# Altium schematic sheet Analog Ball Sensor.SchDoc
size A4
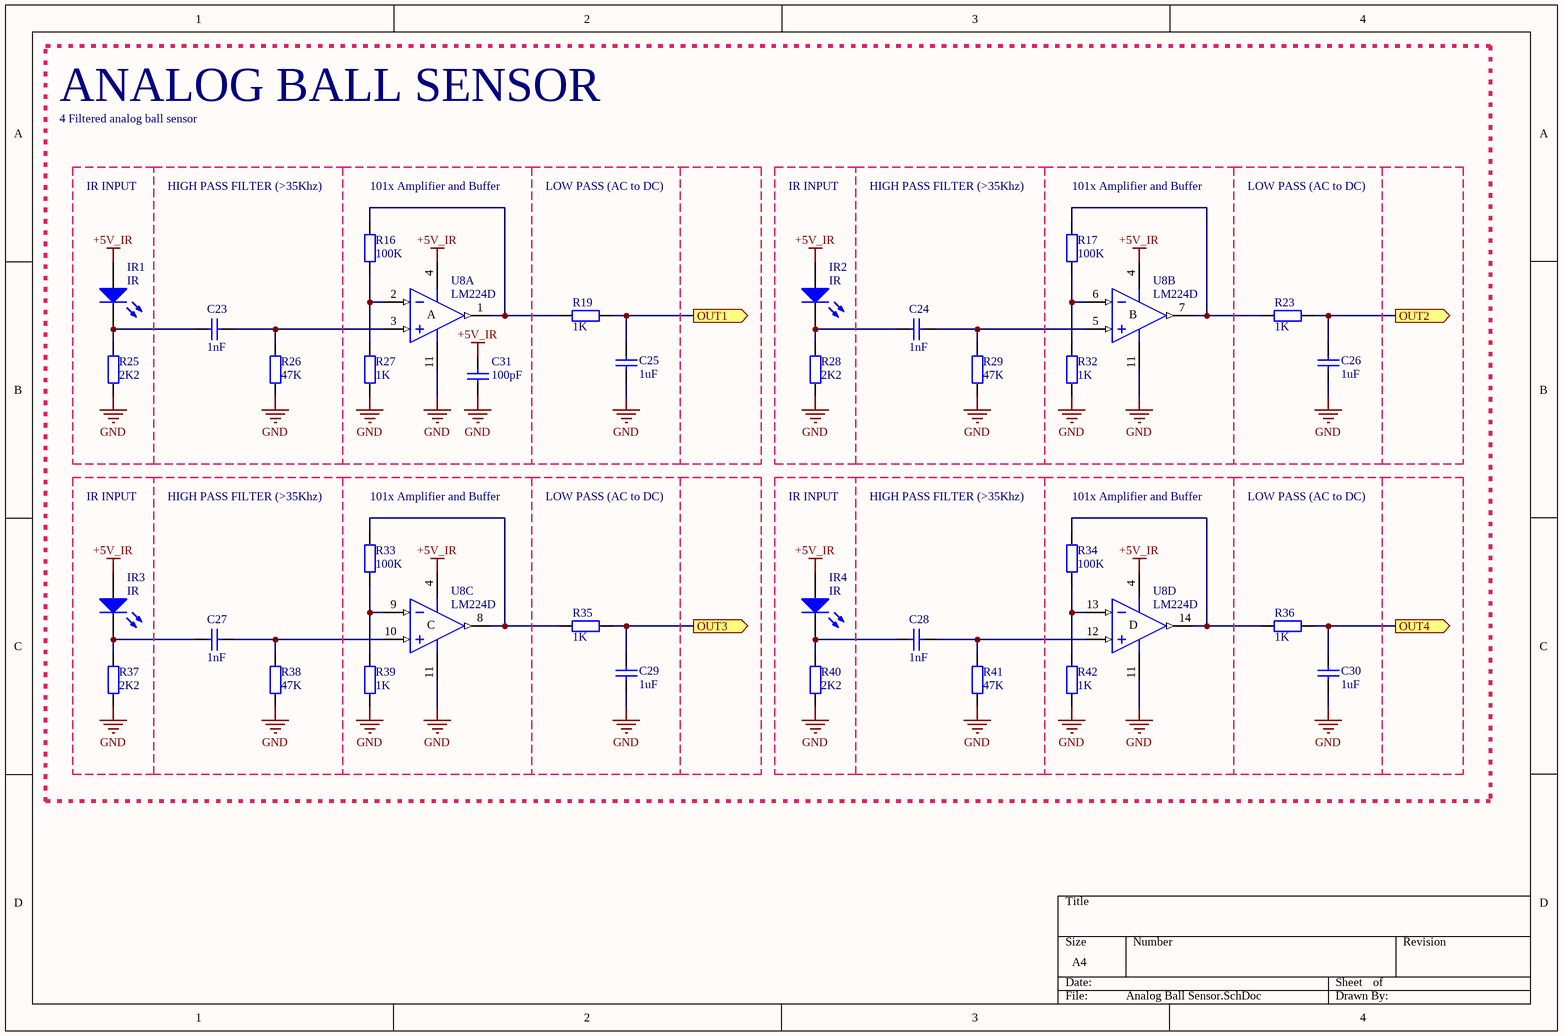
[diagram p0: Analog Ball Sensor.SchDoc]

## Parts
C23  1nF  [C0805]
C24  1nF  [C0805]
C25  1uF  [C0805]
C26  1uF  [C0805]
C27  1nF  [C0805]
C28  1nF  [C0805]
C29  1uF  [C0805]
C30  1uF  [C0805]
C31  value 100pF  [6-0805_N]  (hidden comment: Cap Semi)
IR1  IR  [LED-5mm - Horizontal]
IR2  IR  [LED-5mm - Horizontal]
IR3  IR  [LED-5mm - Horizontal]
IR4  IR  [LED-5mm - Horizontal]
R16  100K  [RES1206]
R17  100K  [RES1206]
R19  1K  [RES1206]
R23  1K  [RES1206]
R25  2K2  [RES1206]
R26  47K  [RES1206]
R27  1K  [RES1206]
R28  2K2  [RES1206]
R29  47K  [RES1206]
R32  1K  [RES1206]
R33  100K  [RES1206]
R34  100K  [RES1206]
R35  1K  [RES1206]
R36  1K  [RES1206]
R37  2K2  [RES1206]
R38  47K  [RES1206]
R39  1K  [RES1206]
R40  2K2  [RES1206]
R41  47K  [RES1206]
R42  1K  [RES1206]
U8  LM224D  [SO14_N]  (parts A,B,C,D of 4)

## Blocks framed on the sheet
ANALOG BALL SENSOR: C23-C31 R16 R17 R19 R23 R26 R27 R29 R32-R36 R38 R39 R41 R42 U8
IR INPUT: IR1 R25
IR INPUT: IR2 R28
IR INPUT: IR3 R37
IR INPUT: IR4 R40

## Ports
OUT1 (out), OUT2 (out), OUT3 (out), OUT4 (out)

## Nets
+5V_IR: C31.2 IR1.1(A) IR2.1(A) IR3.1(A) IR4.1(A) U8.4(V+)
GND: C25.2 C26.2 C29.2 C30.2 C31.1 R25.1 R26.2 R27.2 R28.1 R29.2 R32.2 R37.1 R38.2 R39.2 R40.1 R41.2 R42.2 U8.11(V-)
OUT1: C25.1 R19.2 ; port OUT1
OUT2: C26.1 R23.2 ; port OUT2
OUT3: C29.1 R35.2 ; port OUT3
OUT4: C30.1 R36.2 ; port OUT4
NetC23_1: C23.1 R26.1 U8.3(IN+)
NetC23_2: C23.2 IR1.2(K) R25.2
NetC24_1: C24.1 R29.1 U8.5(IN+)
NetC24_2: C24.2 IR2.2(K) R28.2
NetC27_1: C27.1 R38.1 U8.10(IN+)
NetC27_2: C27.2 IR3.2(K) R37.2
NetC28_1: C28.1 R41.1 U8.12(IN+)
NetC28_2: C28.2 IR4.2(K) R40.2
NetR16_1: R16.1 R19.1 U8.1(OUT)
NetR16_2: R16.2 R27.1 U8.2(IN-)
NetR17_1: R17.1 R23.1 U8.7(OUT)
NetR17_2: R17.2 R32.1 U8.6(IN-)
NetR33_1: R33.1 R35.1 U8.8(OUT)
NetR33_2: R33.2 R39.1 U8.9(IN-)
NetR34_1: R34.1 R36.1 U8.14(OUT)
NetR34_2: R34.2 R42.1 U8.13(IN-)

## Notes on the sheet
- 4 Filtered analog ball sensor
- HIGH PASS FILTER (>35Khz)
- (near R16) 101x Amplifier and Buffer
- LOW PASS (AC to DC)
- (near R17) 101x Amplifier and Buffer
- (near R33) 101x Amplifier and Buffer
- (near R34) 101x Amplifier and Buffer
- (in symbol LM224D, part A) A
- (in symbol LM224D, part B) B
- (in symbol LM224D, part C) C
- (in symbol LM224D, part D) D

## Library data of the parts
C23-C31 = Cap Semi: Capacitor (Semiconductor SIM Model); Published: 8-Jun-2000; LatestRevisionDate: 29-May-2009; LatestRevisionNote: IPC-7351 Footprint Added.; PackageReference: C1206; Publisher: Altium Limited; PackageDescription: Chip Capacitor
IR1-IR4 = LED
R16 R17 R19 R23 R25-R29 R32-R42 = RES
U8 = LM224D: Low-Power Quad Operational Amplifier; Published: 24-Aug-2001; LatestRevisionDate: 13-Apr-2006; LatestRevisionNote: IPC-7351 Footprint Added.; DatasheetVersion: Jun-1999; PackageVersion: Sep-1998; PackageReference: SO14; Publisher: Altium Limited; PackageDescription: 14-Pin Small Outline Integrated Circuit 1.27 mm Pitch; Code_IPC: SOIC127P600-14; ComponentLink1Description: Manufacturer Link; ComponentLink1URL: http://www.st.com/; ComponentLink2Description: Datasheet; ComponentLink2URL: http://www.st.com/stonline/products/literature/ds/2156/lm324.pdf